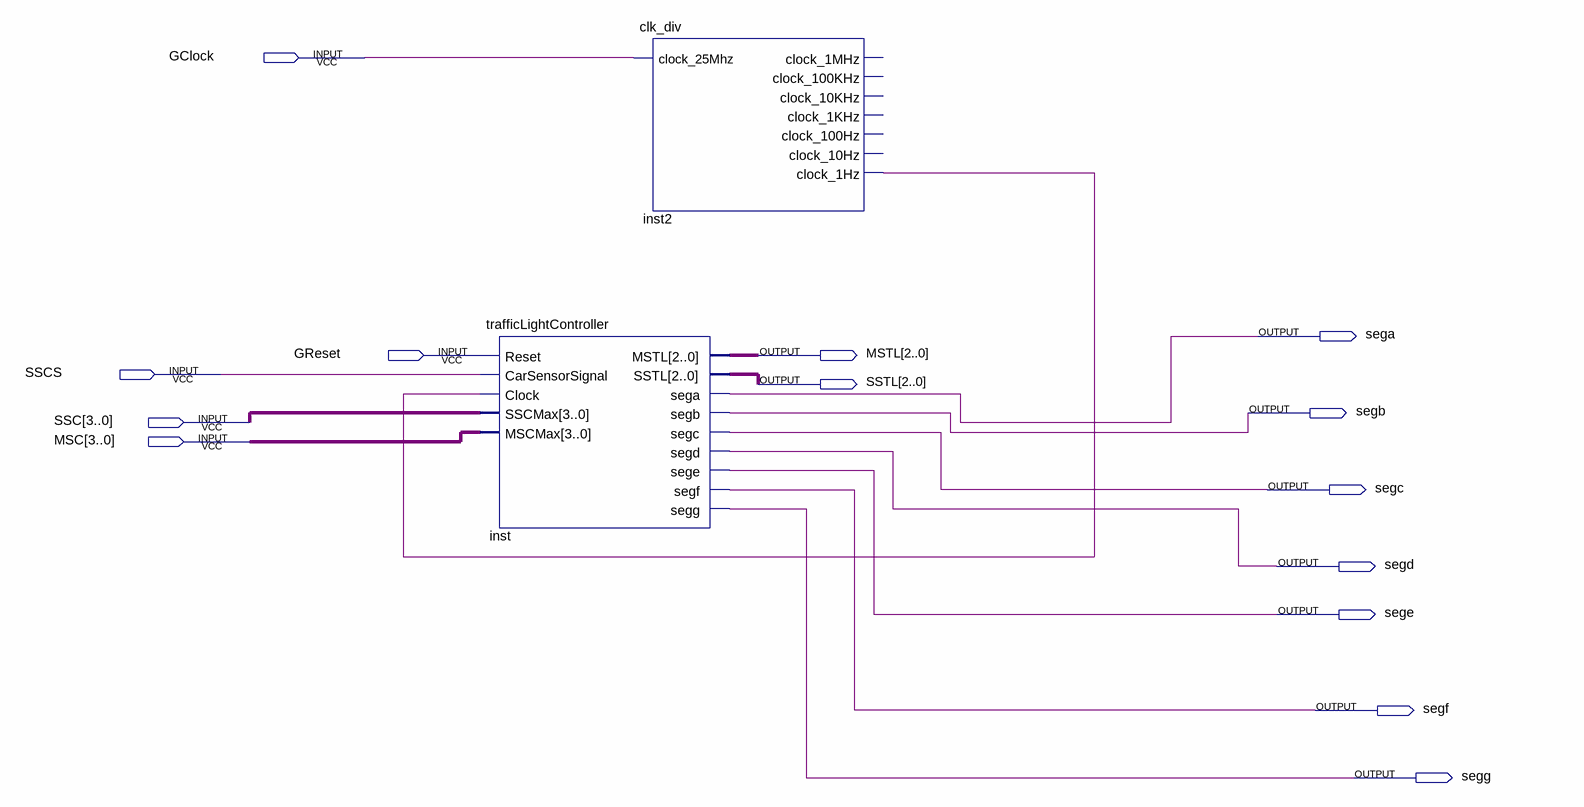
[diagram p0: schematic sheet]
// Quartus schematic TopEntity.bdf as structural Verilog: 2 symbols, 14 pins
module TopEntity (
  input  GClock,
  input  GReset,
  input  SSCS,
  input  [3:0] SSC,
  input  [3:0] MSC,
  output sega,
  output [2:0] MSTL,
  output [2:0] SSTL,
  output segb,
  output segc,
  output segd,
  output sege,
  output segf,
  output segg
);

  wire inst2_clock_1hz;

  trafficLightController inst (
    .CarSensorSignal(SSCS), .Clock(inst2_clock_1hz), .SSCMax(SSC), .MSCMax(MSC), .MSTL(MSTL), .SSTL(SSTL),
    .sega(sega), .segb(segb), .segc(segc), .segd(segd), .sege(sege), .segf(segf), .segg(segg));  // open: Reset
  clk_div inst2 (
    .clock_25Mhz(GClock), .clock_1Hz(inst2_clock_1hz));  // open: clock_1MHz, clock_100KHz, clock_10KHz, clock_1KHz, clock_100Hz, clock_10Hz
endmodule
